# EAGLE design pocket_scope_test_front_end_v0001 (EAGLE 6.4)
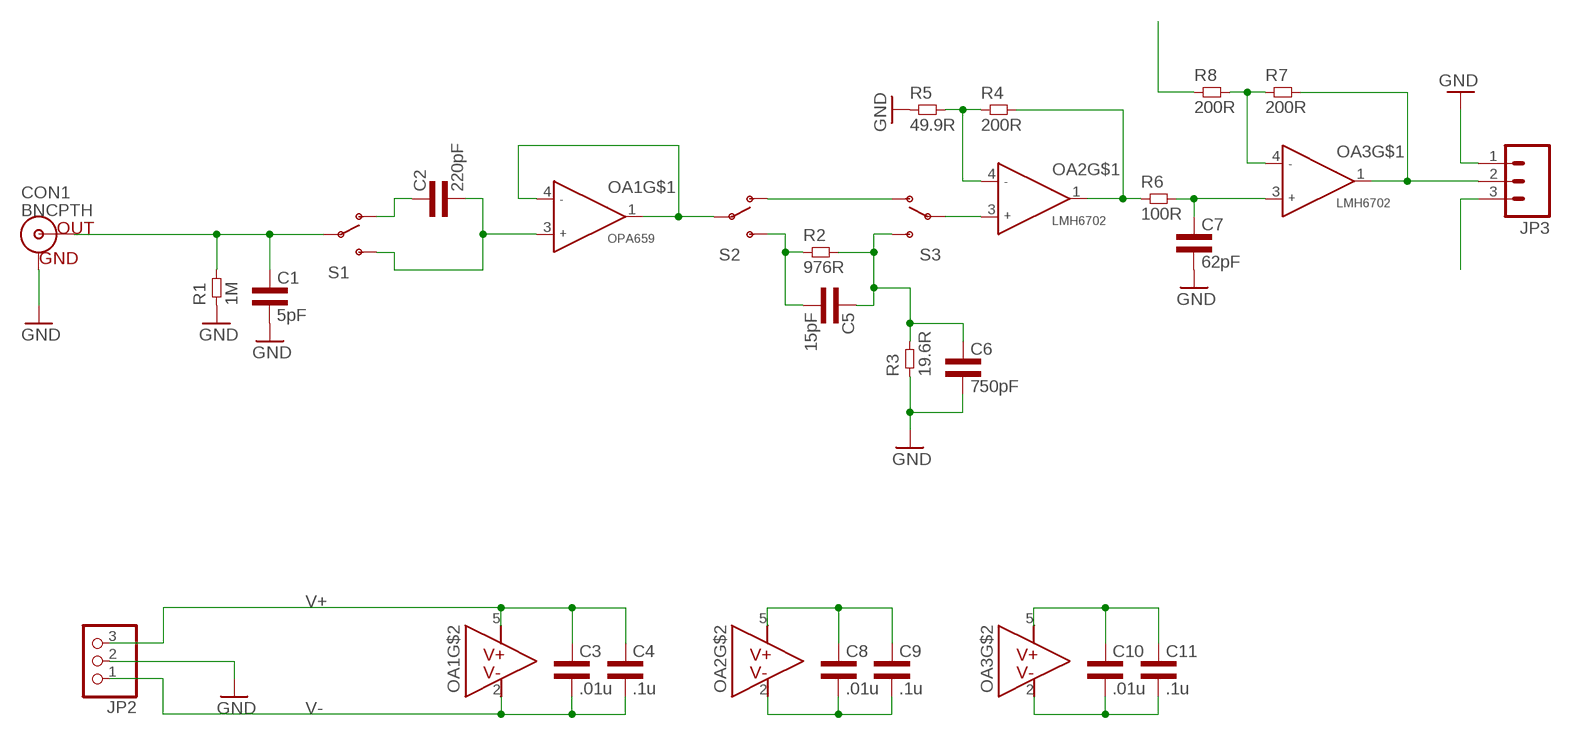
[diagram p0: schematic, sheet 1]

## Parts
C1  5pF  CAP0805L3  [0805L3]
C2  220pF  CAP0805L3  [0805L3]
C3  .01u  CAP0805L3  [0805L3]
C4  .1u  CAP0805L3  [0805L3]
C5  15pF  CAP0805L3  [0805L3]
C6  750pF  CAP0805L3  [0805L3]
C7  62pF  CAP0805L3  [0805L3]
C8  .01u  CAP0805L3  [0805L3]
C9  .1u  CAP0805L3  [0805L3]
C10  .01u  CAP0805L3  [0805L3]
C11  .1u  CAP0805L3  [0805L3]
CON1  BNCPTH  [BNC]
JP2  PINHD-1X3  [1X03]
JP3  M03LOCK  [1X03_LOCK]
OA1  OPA659  OPA659DBV  [R-PDSO-G5]
OA2  LMH6702  OPA659DBV  [R-PDSO-G5]
OA3  LMH6702  OPA659DBV  [R-PDSO-G5]
R1  1M  RES0805L3  [0805L3]
R2  976R  RES0805L3  [0805L3]
R3  19.6R  RES0805L3  [0805L3]
R4  200R  RES0805L3  [0805L3]
R5  49.9R  RES0805L3  [0805L3]
R6  100R  RES0805L3  [0805L3]
R7  200R  RES0805L3  [0805L3]
R8  200R  RES0805L3  [0805L3]
S1  SPARKFUN-ELECTROMECHANICAL_SWITCH-SPDTPTH_LOCK  [SPARKFUN-ELECTROMECHANICAL_SWITCH-SPDT_LOCK.007S]
S2  SPARKFUN-ELECTROMECHANICAL_SWITCH-SPDTPTH_LOCK  [SPARKFUN-ELECTROMECHANICAL_SWITCH-SPDT_LOCK.007S]
S3  SPARKFUN-ELECTROMECHANICAL_SWITCH-SPDTPTH_LOCK  [SPARKFUN-ELECTROMECHANICAL_SWITCH-SPDT_LOCK.007S]

## Nets
GND: C1.2 C6.2 C7.2 CON1.GND JP2.2 JP3.1 R1.1 R3.1 R5.1
N$1: C2.2 OA1.3(INA+) S1.3(S)
N$2: C2.1 S1.1(O)
N$4: OA1.1(OUTA) OA1.4(INA-) S2.2(P)
N$5: C1.1 CON1.S(OUT) R1.2 S1.2(P)
N$8: C5.2 R2.1 S2.3(S)
N$9: C5.1 C6.1 R2.2 R3.2 S3.3(S)
N$10: S2.1(O) S3.1(O)
N$11: OA2.3(INA+) S3.2(P)
N$12: OA2.4(INA-) R4.1 R5.2
N$13: OA2.1(OUTA) R4.2 R6.1
N$14: C7.1 OA3.3(INA+) R6.2
N$15: JP3.2 OA3.1(OUTA) R7.2
N$16: OA3.4(INA-) R7.1 R8.2
V+: C3.1 C4.1 C8.1 C9.1 C10.1 C11.1 JP2.3 OA1.5(V+) OA2.5(V+) OA3.5(V+)
V-: C3.2 C4.2 C8.2 C9.2 C10.2 C11.2 JP2.1 OA1.2(V-) OA2.2(V-) OA3.2(V-)
V_OS: JP3.3 R8.1

## Library data of the parts
C1-C11 = common:CAP
CON1 = SparkFun-Connectors:BNC: BNC Connector, Mouser Part# 5227161
JP2 = adafruit:PINHD-1X3: PIN HEADER
JP3 = SparkFun-Connectors:M03: Header 3 Standard 3-pin 0.1" header. Use with straight break away headers (SKU : PRT-00116), right angle break away headers (PRT-00553), swiss pins (PRT-00743), machine pins (PRT-00117), and female headers (PRT-00115). Molex polarized connector foot print use with SKU : PRT-08232 with associated crimp pins and housings.
OA1-OA3 = common:OPA659
R1-R8 = common:RES
S1-S3 = my_dac_amp:SPARKFUN-ELECTROMECHANICAL_SWITCH-SPDT: SPDT Switch Simple slide switch, Spark Fun Electronics SKU : COM-00102 DPDT SMT slide switch, AYZ0202, SWCH-08179

## Board
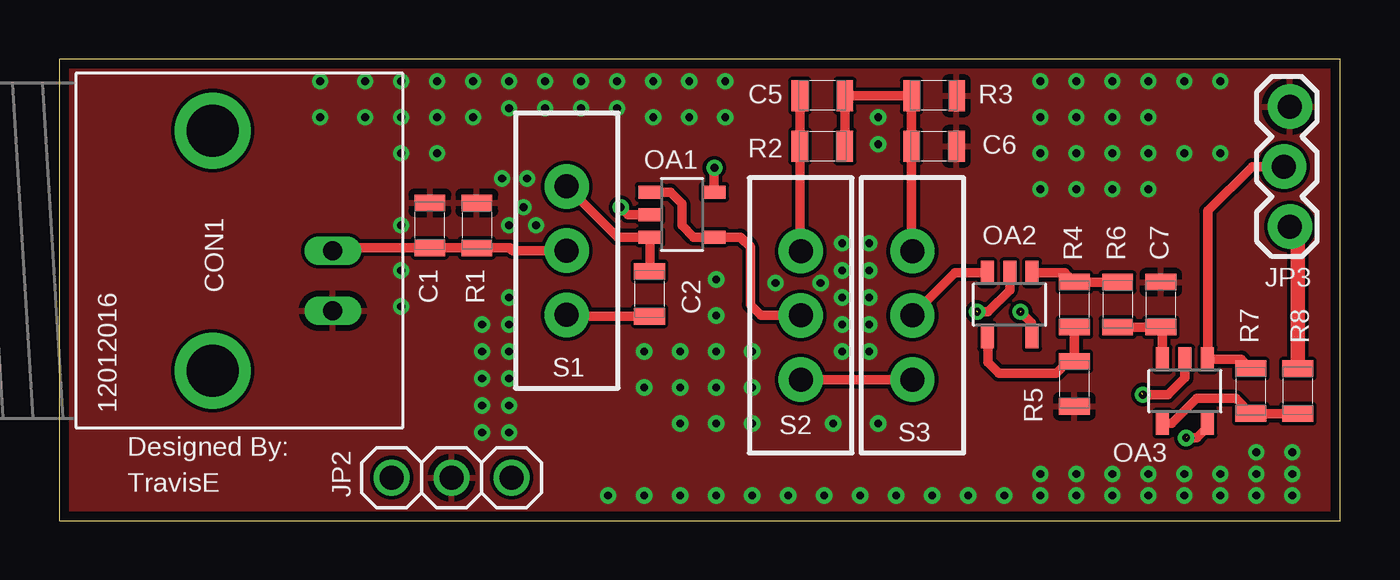
[diagram p1: board, top side]
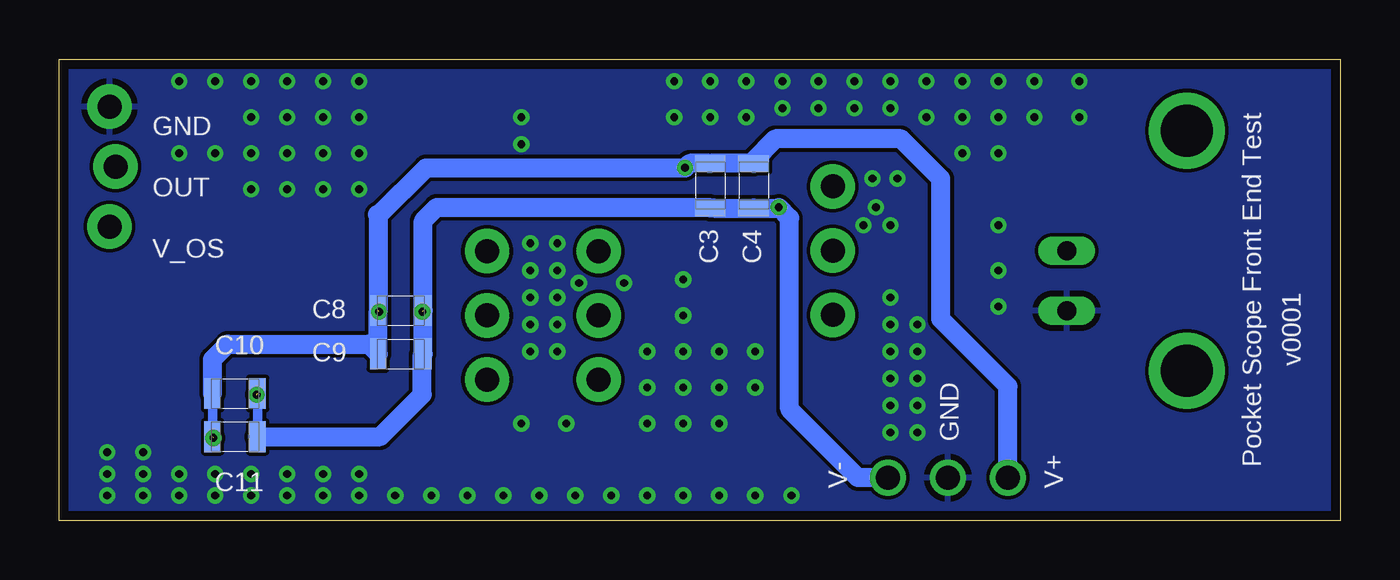
[diagram p2: board, bottom side, seen from below]

Size 54.23 x 19.53 mm. Coordinates in mm from the lower left corner, seen from the top.
Outline: 0,0 54.23,0 54.23,19.53 0,19.53 0,0
Copper layers (1*16): Top 0.035mm / dielectric 1.5mm / Bottom 0.035mm
Design rules "osh_2_layer": minimum track width 6mil, minimum drill 13mil, track to track 6mil, track to pad 6mil, pad to pad 6mil, via to via 6mil, smd to smd 0mil, copper to edge 16mil, drill to drill 8mil, minimum pad ring 7mil, minimum via ring 7mil, stop-mask expansion 4mil, vias tented up to drill 16mil, thermal gap 10mil

### Footprints (pad centres in the part's own frame; a part is rotated, then mirrored left to right if it is on the bottom)
0805L3 = smd 0.7 x 1.3: 1 -0.95,0; 2 0.95,0
BNC = drill 2.2: 3 -5.08,5.08; 4 5.08,5.08 | drill 0.8 long: GND -2.54,0; S 0,0
1X03 = drill 1.016: 1 -2.54,0; 2 0,0; 3 2.54,0
1X03_LOCK = drill 1.016 pad 1.88: 1 0,0.127; 2 2.54,-0.127; 3 5.08,0.127
R-PDSO-G5 = smd 0.55 x 1: 1 -0.95,-1.35; 2 0,-1.35; 3 0.95,-1.35; 4 0.95,1.35; 5 -0.95,1.35
SPARKFUN-ELECTROMECHANICAL_SWITCH-SPDT_LOCK.007S = drill 1.016 pad 1.88: 1 0,2.718; 2 0,0; 3 0,-2.718

### Placement (x,y rotation side)
C1  15.7,12.5 90 top
C2  24.99,9.6 90 top
C3  26.67,14.17 270 bottom
C4  24.84,14.17 270 bottom
C5  32.31,17.98 180 top
C6  37.03,15.85 0 top
C7  46.63,9.14 90 top
C8  39.78,8.89 0 bottom
C9  39.78,7.06 0 bottom
C10  46.79,5.38 0 bottom
C11  46.79,3.56 0 bottom
CON1  11.58,11.43 90 top
JP2  16.61,1.83 180 top
JP3  51.97,17.53 270 top
OA1  26.37,12.95 270 top
OA2  40.23,9.14 180 top
OA3  47.65,5.49 180 top
R1  17.68,12.5 270 top
R2  32.31,15.85 0 top
R3  37.03,17.98 180 top
R4  42.98,9.14 90 top
R5  42.98,5.79 90 top
R6  44.81,9.14 270 top
R7  50.44,5.49 90 top
R8  52.43,5.49 270 top
S1  21.49,11.43 180 top
S2  31.39,8.69 180 top
S3  36.12,8.69 180 top

### Tracks (layer width: path | path; a pad name or v marks a point on that pad's centre or on a via)
GND  (via drill 0.33)
  other vias: 11.05,18.59 12.95,18.59 14.48,18.59 16,18.59 17.53,18.59 19.05,18.59 20.57,18.59 22.1,18.59 23.62,18.59 25.15,18.59 26.67,18.59 28.19,18.59 11.05,17.07 12.95,17.07 14.48,17.07 16,17.07 17.53,17.07 25.15,17.07 26.67,17.07 28.19,17.07 19.05,17.45 20.57,17.45 22.1,17.45 23.62,17.45 14.48,15.54 16,15.54 14.48,12.5 18.75,14.48 19.05,12.5 14.48,10.59 14.48,9.07 17.91,6.02 19.05,6.02 17.91,4.88 17.91,3.73 19.05,3.73 19.05,4.88 17.91,7.16 19.05,7.16 19.05,8.31 19.05,9.45 17.91,8.31 23.24,1.07 24.77,1.07 26.29,1.07 27.81,1.07 29.34,1.07 30.86,1.07 32.38,1.07 33.91,1.07 35.43,1.07 36.96,1.07 38.48,1.07 40.01,1.07 41.53,1.07 43.05,1.07 44.58,1.07 46.1,1.07 47.62,1.07 49.15,1.07 50.67,1.07 52.2,1.07 49.15,1.98 50.67,1.98 47.62,1.98 46.1,1.98 44.58,1.98 43.05,1.98 41.53,1.98 41.53,18.59 43.05,18.59 44.58,18.59 46.1,18.59 47.62,18.59 49.15,18.59 41.53,17.07 43.05,17.07 44.58,17.07 46.1,17.07 41.53,15.54 43.05,15.54 44.58,15.54 46.1,15.54 47.62,15.54 49.15,15.54 41.53,14.02 43.05,14.02 44.58,14.02 46.1,14.02 34.67,17.07 34.67,15.93 24.77,7.16 26.29,7.16 27.81,7.16 29.34,7.16 24.77,5.64 26.29,5.64 27.81,5.64 29.34,5.64 27.81,8.69 27.81,10.21 30.33,10.06 32.23,10.06 33.15,11.73 34.29,11.73 34.29,10.59 34.29,9.45 34.29,8.31 34.29,7.16 33.15,10.59 33.15,9.45 33.15,8.31 33.15,7.16 19.66,13.26 19.81,14.48 20.19,12.5 26.29,4.11 27.81,4.11 29.34,4.11 32.77,4.11 34.67,4.11 52.2,1.98 52.2,2.9 50.67,2.9
  pour Top: 0.3,19.2 53.95,19.2 53.95,0.3 0.3,0.3
  pour Bottom: 0.3,19.2 53.95,19.2 53.95,0.3 0.3,0.3
N$1
  Top 0.406: S1.3 23.63,12 OA1.3 25.02,10.57 C2.2
N$2
  Top 0.406: C2.1 21.55,8.65 S1.1
N$4
  Top 0.406: OA1.1 25.87,13.9 26.37,13.41 26.37,12.5 26.86,12 OA1.4 28.84,12 29.26,11.58 29.26,9.14 29.72,8.69 S2.2
N$5
  Top 0.406: S1.2 19.2,11.43 19.09,11.55 R1.2 C1.1 11.7,11.55 CON1.S
N$8
  Top 0.406: S2.3 31.36,11.44 R2.1 C5.2
N$9
  Top 0.406: R2.2 C5.1 R3.2 C6.1 36.08,11.44 S3.3
N$10
  Top 0.406: S2.1 S3.1
N$11
  Top 0.406: OA2.3 37.93,10.49 S3.2
N$12
  Top 0.406: R4.1 R5.2 42.71,6.74 42.22,6.25 39.78,6.25 39.32,6.71 39.32,7.76 OA2.4
N$13
  Top 0.406: OA2.1 42.58,10.49 R4.2 R6.1
N$14
  Top 0.406: R6.2 C7.1 46.7,8.13 OA3.3
N$15
  Top 0.406: R7.2 50.04,6.84 OA3.1 48.62,6.85 48.62,13.11 50.5,14.99 JP3.2
N$16
  Top 0.406: R8.2 R7.1 49.8,5.18 48.16,5.18 47.09,4.11 46.72,4.11 OA3.4
V+  (via drill 0.33)  (2 unrouted)
  Top 0.406: OA2.5 41.15,7.76 41.15,8.38 v40.69,8.84 | OA1.5 27.72,14.91 v27.74,14.93 | OA3.5 48.6,3.95 48.16,3.5 v47.7,3.5
  Bottom 0.406: C3.1 26.71,15.12 | C11.1 C10.1 | 24.81,15.09 C4.1 24.84,15.24 | 40.84,8.99 40.83,8.99 C8.1
  Bottom 0.813: 24.84,15.24 23.93,16.15 18.59,16.15 16.92,14.48 16.92,8.53 14.07,5.69 JP2.3 | C4.1 C3.1 | 26.71,15.12 27.55,15.12 v27.74,14.93 38.71,14.93 40.73,12.92 | 40.73,12.92 C8.1 C9.1 41.13,7.47 47.09,7.47 47.74,6.82 C10.1 | 40.76,12.95 40.73,12.92
V-  (via drill 0.33)  (2 unrouted)
  Top 0.406: OA1.2 24.08,12.95 v23.77,13.26 | OA2.2 40.23,9.75 39.32,8.84 v38.86,8.84 | OA3.2 47.65,6.04 46.94,5.33 v45.87,5.33
  Bottom 0.406: C10.2 C11.2 | C3.2 26.52,13.22 26.55,13.26 26.82,13.26
  Bottom 0.61: 24.81,13.26 C4.2
  Bottom 0.813: C3.2 26.71,13.26 38.25,13.26 38.83,12.68 C8.2 C9.2 38.86,7.03 38.86,5.33 40.64,3.56 C11.2 | 26.52,13.22 C4.2 23.81,13.22 v23.77,13.26 23.32,12.8 23.32,4.72 20.42,1.83 JP2.1
V_OS
  Top 0.61: R8.1 52.43,12.12 JP3.3

### Text on the board
tPlace: 12012016 | Designed By: | TravisE
bPlace: GND | OUT | V_OS | v0001 | GND | Pocket Scope Front End Test | V+ | V-
Reference: Pocket Scope | Front End Test v0001 | C1 - 5pF | R1 - 1M | OA1 - OPA659IDBVT | C2 - 220pF | R2 - 976 | OA2 - LMH6702MF/NOPB | C3 - .01uF | R3 - 19.6 | OA3 - LMH6702MF/NOPB | C4 - .1uF | C5 - 15pF | R4 - 200 | R5 - 49.9 | C6 - 750pF | R6 - 100 | C7 - 62pF | R7 - 200 | C8 - .01uF | R8 - 200 | C10 - .01uF | C9 - .1uF | C11 - .1uF